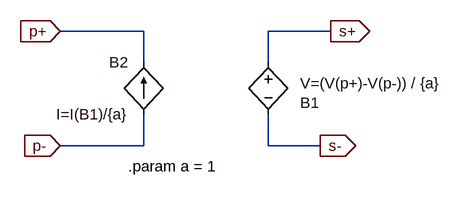
[diagram p0: schematic trafo_ideal.asc]
trafo_ideal.asc, the LTspice schematic file:
Version 4
SHEET 1 880 680
WIRE -16 80 -144 80
WIRE 272 80 176 80
WIRE -16 128 -16 80
WIRE 176 128 176 80
WIRE -16 256 -16 208
WIRE -16 256 -144 256
WIRE 176 256 176 208
WIRE 256 256 176 256
FLAG 272 80 s+
IOPIN 272 80 Out
FLAG 256 256 s-
IOPIN 256 256 Out
FLAG -144 80 p+
IOPIN -144 80 In
FLAG -144 256 p-
IOPIN -144 256 In
SYMBOL bi -16 208 R180
WINDOW 0 24 80 Left 2
WINDOW 3 24 0 Left 2
SYMATTR InstName B2
SYMATTR Value I=I(B1)/{a}
SYMBOL bv 176 112 R0
WINDOW 3 49 48 Left 2
WINDOW 0 49 78 Left 2
SYMATTR Value V=(V(p+)-V(p-)) / {a}
SYMATTR InstName B1
TEXT -40 288 Left 2 !.param a = 1

The netlist it stands for:
* trafo_ideal.asc
B2 p- p+ I=I(B1)/{a}
B1 s+ s- V=(V(p+)-V(p-)) / {a}
.param a = 1
.backanno
.end